# EAGLE design sendai (EAGLE 9.1.3)
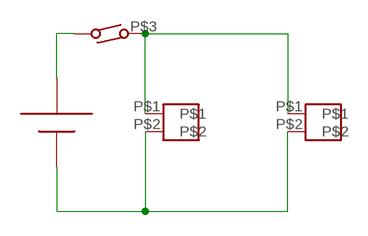
[diagram p0: schematic, sheet 1]

## Parts
U$1  CR2032_CR2032  [CR2032_CR2032]
U$2  CONNECTER_CON2  [CONNECTER_CON2]
U$3  CONNECTER_CON2  [CONNECTER_CON2]
U$4  LEAD_SWITCH_LEAD_SWITCH  [LEAD_SWITCH_LEAD_SWITCH]

## Nets
N$1: U$2.P$1 U$3.P$1 U$4.P$3
N$2: U$1.-1(-) U$2.P$2 U$3.P$2
N$3: U$1.P$1(+) U$1.P$2(+) U$4.P$4

## Library data of the parts
U$1 = sendai:CR2032_CR2032
U$2 U$3 = sendai:CONNECTER_CON2
U$4 = sendai:LEAD_SWITCH_LEAD_SWITCH

## Board
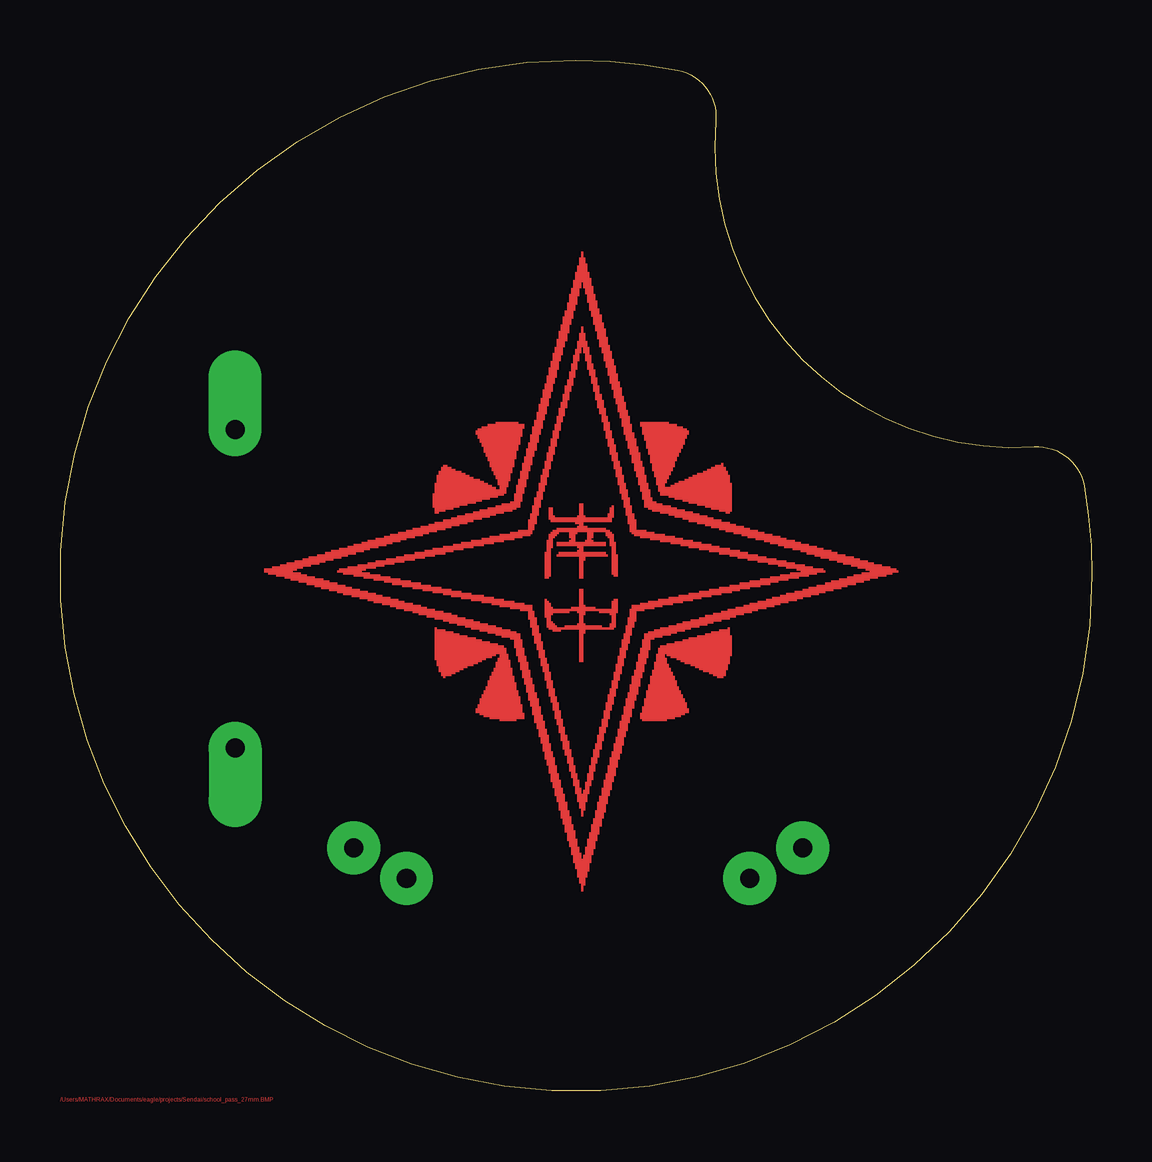
[diagram p1: board, top side]
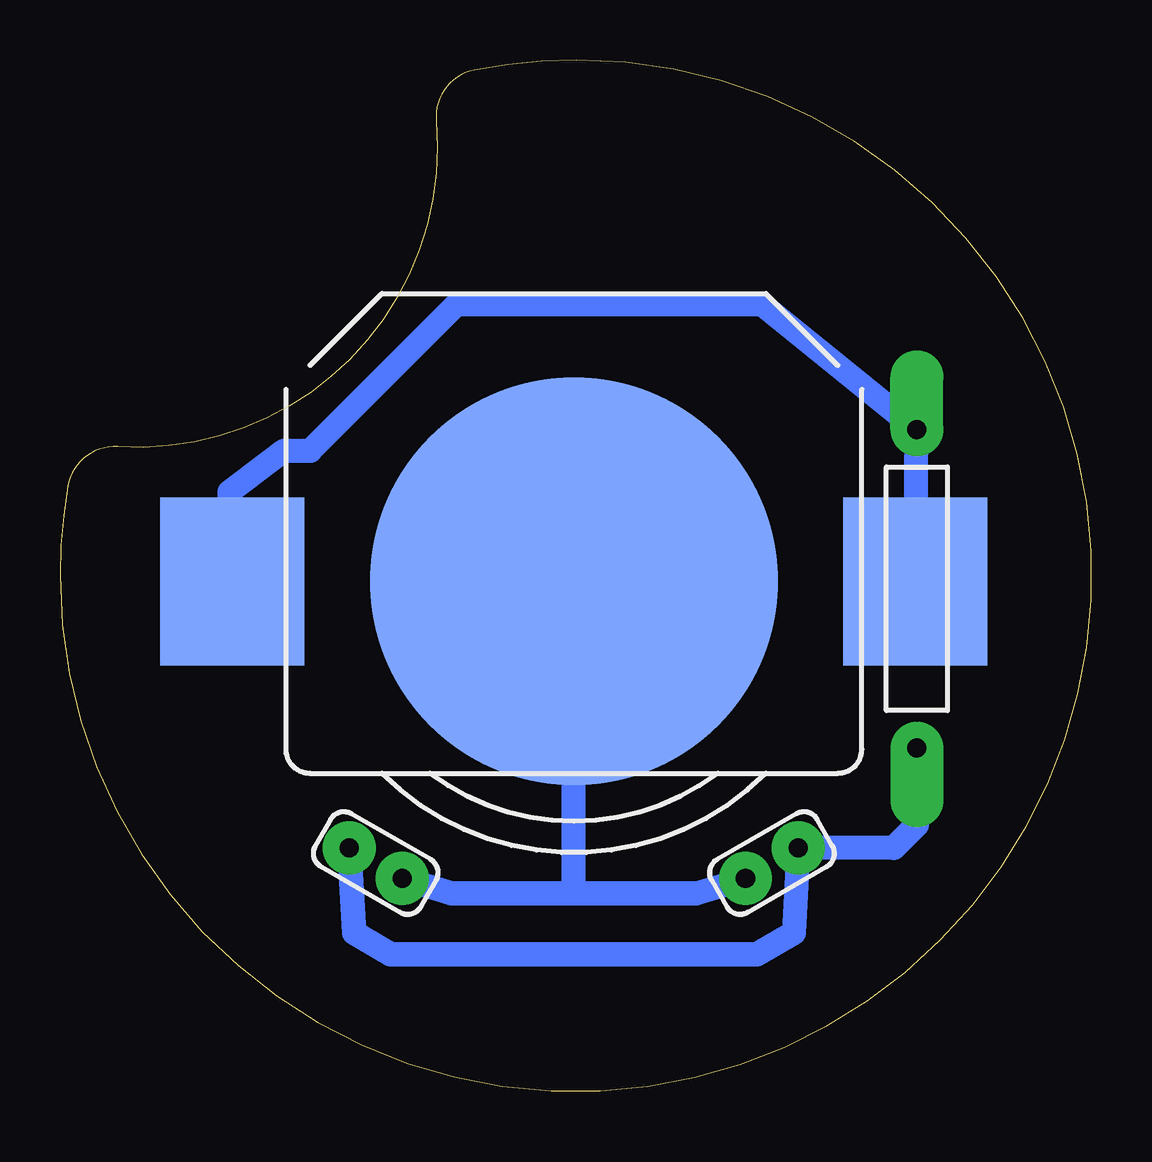
[diagram p2: board, bottom side, seen from below]

Size 42.98 x 42.98 mm. Coordinates in mm from the lower left corner, seen from the top.
Outline: 30.91,30.49 arc49 40.56,26.85 arc-83 42.65,25.22 arc-10 42.98,21.48 arc-93 20.46,0 arc-84 0,20.46 arc-93 21.48,42.98 arc-11 25.72,42.55 arc-83 27.3,40.44 arc50 30.91,30.49
Copper layers (1*16): Top 0.035mm / dielectric 1.5mm / Bottom 0.035mm
Design rules "default": minimum track width 6mil, minimum drill 0.35mm, track to track 6mil, track to pad 6mil, pad to pad 6mil, via to via 6mil, smd to smd 6mil, copper to edge 40mil, drill to drill 6mil, minimum pad ring 10mil, minimum via ring 8mil, stop-mask expansion 4mil, vias tented up to drill 0mil, thermal gap 10mil

### Footprints (pad centres in the part's own frame; a part is rotated, then mirrored left to right if it is on the bottom)
CR2032_CR2032 = smd 17 x 17: -1 0,0 | smd 6 x 7: P$1 -14.224,0; P$2 14.224,0
CONNECTER_CON2 = drill 0.8 pad 2.2: P$1 -1.27,0; P$2 1.27,0
LEAD_SWITCH_LEAD_SWITCH = drill 0.8 pad 2.2 offset: P$3 -6.635,0; P$4 6.635,0

### Placement (x,y rotation side)
U$1  21.57,21.24 0 bottom
U$2  13.31,9.5 210 bottom
U$3  29.82,9.5 330 bottom
U$4  7.27,20.93 90 bottom

### Tracks (layer width: path | path; a pad name or v marks a point on that pad's centre or on a via)
N$1
  Bottom 1: 12.41,6.59 U$2.P$1 8.23,10.14
  Bottom 1.016: 12.41,6.59 13.95,5.69 29.19,5.69 30.72,6.59 U$3.P$1 | U$4.P$3 7.27,11.09 8.23,10.14
N$2
  Bottom 1: 16.49,8.23 U$2.P$2 | 21.57,8.23 U$1.-1
  Bottom 1.016: U$3.P$2 26.65,8.23 21.57,8.23 16.49,8.23
N$3
  Bottom 1: U$1.P$1 35.91,24.98 33.65,26.69 32.55,26.69 26.45,32.79 13.73,32.79 U$4.P$4 U$1.P$2
(copper drawn outside any net)
  shapes: Top area x1451

### Text on the board
Top: /Users/MATHRAX/Documents/eagle/projects/Sendai/school_pass_27mm.BMP
tStop: /Users/MATHRAX/Documents/eagle/projects/Sendai/school_pass_27mm.BMP